# Altium schematic sheet Main.schdoc: Eurocard VME 6U with break-away tab (9.187 x 6.299 inches)
size A3; Organization: Organization; Address1: Address1; Address2: Address2; Address3: Address3; Address4: Address4; DocumentNumber: 1; Revision: 0; SheetNumber: 2; SheetTotal: 2
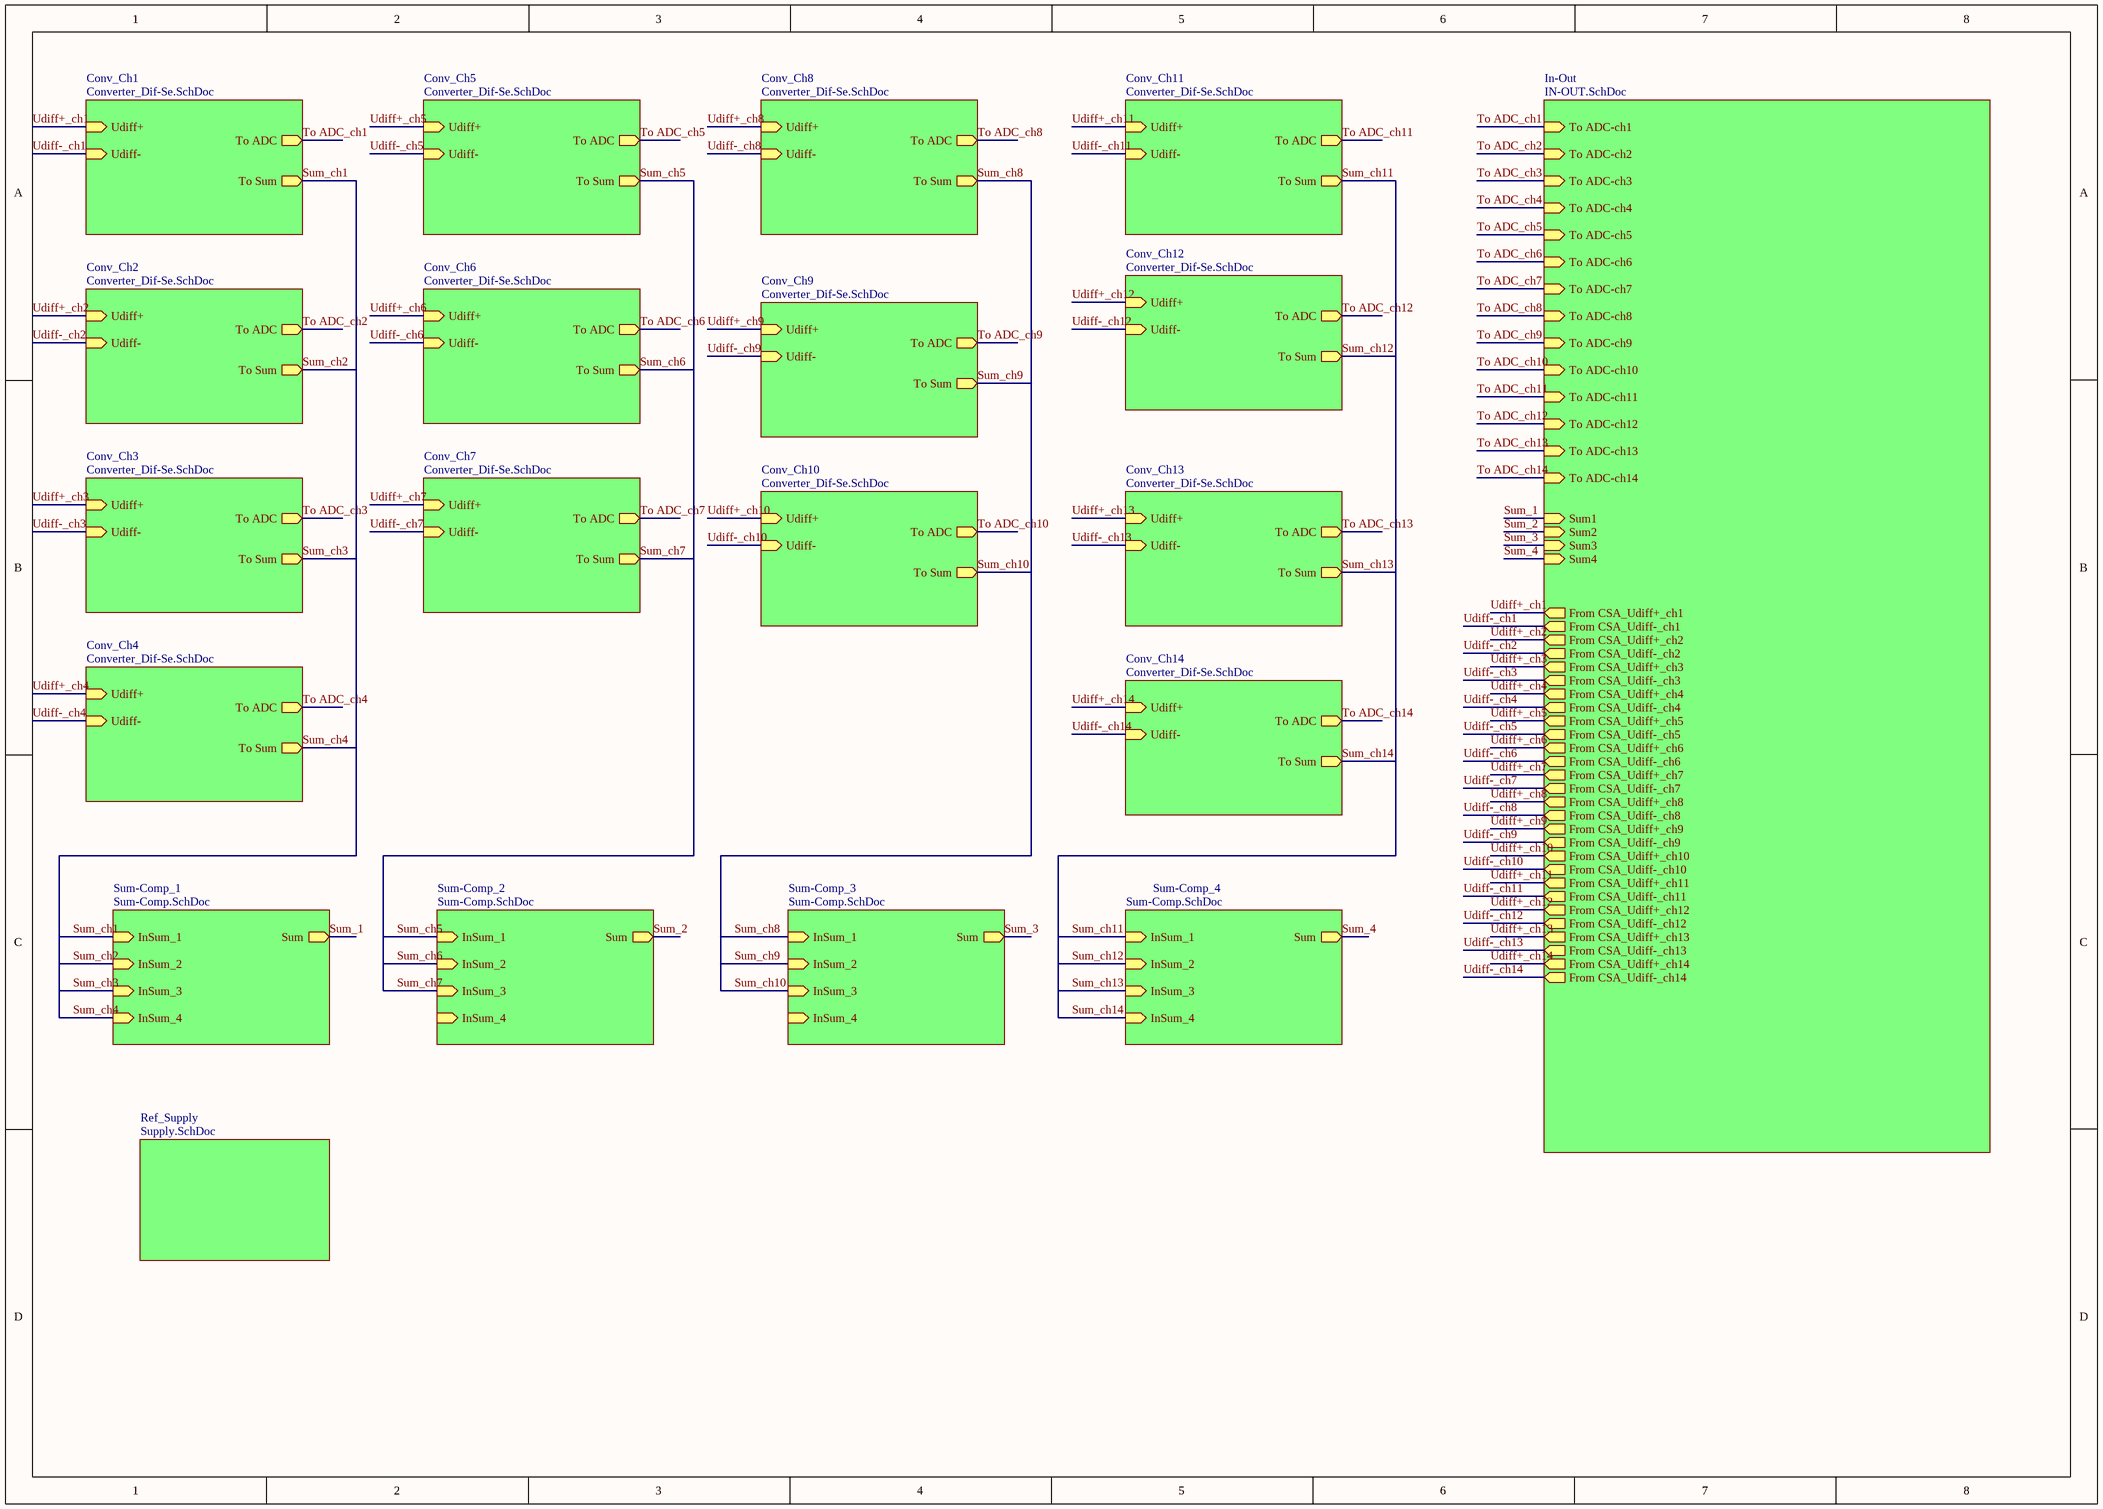
[diagram p0: Main.schdoc]

## Sub-sheets
Conv_Ch1 = Converter_Dif-Se.SchDoc: To ADC (out), To Sum (out), Udiff+ (in), Udiff- (in)
Conv_Ch2 = Converter_Dif-Se.SchDoc: To ADC (out), To Sum (out), Udiff+ (in), Udiff- (in)
Conv_Ch3 = Converter_Dif-Se.SchDoc: To ADC (out), To Sum (out), Udiff+ (in), Udiff- (in)
Conv_Ch4 = Converter_Dif-Se.SchDoc: To ADC (out), To Sum (out), Udiff+ (in), Udiff- (in)
Conv_Ch5 = Converter_Dif-Se.SchDoc: To ADC (out), To Sum (out), Udiff+ (in), Udiff- (in)
Conv_Ch6 = Converter_Dif-Se.SchDoc: To ADC (out), To Sum (out), Udiff+ (in), Udiff- (in)
Conv_Ch7 = Converter_Dif-Se.SchDoc: To ADC (out), To Sum (out), Udiff+ (in), Udiff- (in)
Conv_Ch8 = Converter_Dif-Se.SchDoc: To ADC (out), To Sum (out), Udiff+ (in), Udiff- (in)
Conv_Ch9 = Converter_Dif-Se.SchDoc: To ADC (out), To Sum (out), Udiff+ (in), Udiff- (in)
Conv_Ch10 = Converter_Dif-Se.SchDoc: To ADC (out), To Sum (out), Udiff+ (in), Udiff- (in)
Conv_Ch11 = Converter_Dif-Se.SchDoc: To ADC (out), To Sum (out), Udiff+ (in), Udiff- (in)
Conv_Ch12 = Converter_Dif-Se.SchDoc: To ADC (out), To Sum (out), Udiff+ (in), Udiff- (in)
Conv_Ch13 = Converter_Dif-Se.SchDoc: To ADC (out), To Sum (out), Udiff+ (in), Udiff- (in)
Conv_Ch14 = Converter_Dif-Se.SchDoc: To ADC (out), To Sum (out), Udiff+ (in), Udiff- (in)
In-Out = IN-OUT.SchDoc: To ADC-ch1 (in), To ADC-ch2 (in), To ADC-ch3 (in), To ADC-ch4 (in), To ADC-ch5 (in), To ADC-ch6 (in), To ADC-ch7 (in), To ADC-ch8 (in), To ADC-ch9 (in), To ADC-ch10 (in), To ADC-ch11 (in), To ADC-ch12 (in), To ADC-ch13 (in), To ADC-ch14 (in), From CSA_Udiff+_ch1 (out), From CSA_Udiff+_ch2 (out), From CSA_Udiff+_ch3 (out), From CSA_Udiff+_ch4 (out), From CSA_Udiff+_ch5 (out), From CSA_Udiff+_ch6 (out), From CSA_Udiff+_ch7 (out), From CSA_Udiff+_ch8 (out), From CSA_Udiff+_ch9 (out), From CSA_Udiff+_ch10 (out), From CSA_Udiff+_ch11 (out), From CSA_Udiff+_ch12 (out), From CSA_Udiff+_ch13 (out), From CSA_Udiff+_ch14 (out), From CSA_Udiff-_ch1 (out), From CSA_Udiff-_ch2 (out), From CSA_Udiff-_ch3 (out), From CSA_Udiff-_ch4 (out), From CSA_Udiff-_ch5 (out), From CSA_Udiff-_ch6 (out), From CSA_Udiff-_ch7 (out), From CSA_Udiff-_ch8 (out), From CSA_Udiff-_ch9 (out), From CSA_Udiff-_ch10 (out), From CSA_Udiff-_ch11 (out), From CSA_Udiff-_ch12 (out), From CSA_Udiff-_ch13 (out), From CSA_Udiff-_ch14 (out), Sum4 (in), Sum3 (in), Sum2 (in), Sum1 (in)
Ref_Supply = Supply.SchDoc: no entries
Sum-Comp_1 = Sum-Comp.SchDoc: InSum_1 (in), InSum_2 (in), InSum_3 (in), InSum_4 (in), Sum (out)
Sum-Comp_2 = Sum-Comp.SchDoc: InSum_1 (in), InSum_2 (in), InSum_3 (in), InSum_4 (in), Sum (out)
Sum-Comp_3 = Sum-Comp.SchDoc: InSum_1 (in), InSum_2 (in), InSum_3 (in), InSum_4 (in), Sum (out)
Sum-Comp_4 = Sum-Comp.SchDoc: InSum_1 (in), InSum_2 (in), InSum_3 (in), InSum_4 (in), Sum (out)

## Nets
Sum_1: sheet Sum-Comp_1/Sum, sheet In-Out/Sum1
Sum_2: sheet Sum-Comp_2/Sum, sheet In-Out/Sum2
Sum_3: sheet Sum-Comp_3/Sum, sheet In-Out/Sum3
Sum_4: sheet Sum-Comp_4/Sum, sheet In-Out/Sum4
Sum_ch1: sheet Conv_Ch1/To Sum, sheet Sum-Comp_1/InSum_1
Sum_ch2: sheet Sum-Comp_1/InSum_2, sheet Conv_Ch2/To Sum
Sum_ch3: sheet Sum-Comp_1/InSum_3, sheet Conv_Ch3/To Sum
Sum_ch4: sheet Sum-Comp_1/InSum_4, sheet Conv_Ch4/To Sum
Sum_ch5: sheet Sum-Comp_2/InSum_1, sheet Conv_Ch5/To Sum
Sum_ch6: sheet Sum-Comp_2/InSum_2, sheet Conv_Ch6/To Sum
Sum_ch7: sheet Sum-Comp_2/InSum_3, sheet Conv_Ch7/To Sum
Sum_ch8: sheet Sum-Comp_3/InSum_1, sheet Conv_Ch8/To Sum
Sum_ch9: sheet Sum-Comp_3/InSum_2, sheet Conv_Ch9/To Sum
Sum_ch10: sheet Sum-Comp_3/InSum_3, sheet Conv_Ch10/To Sum
Sum_ch11: sheet Sum-Comp_4/InSum_1, sheet Conv_Ch11/To Sum
Sum_ch12: sheet Sum-Comp_4/InSum_2, sheet Conv_Ch12/To Sum
Sum_ch13: sheet Sum-Comp_4/InSum_3, sheet Conv_Ch13/To Sum
Sum_ch14: sheet Sum-Comp_4/InSum_4, sheet Conv_Ch14/To Sum
To ADC_ch1: sheet Conv_Ch1/To ADC, sheet In-Out/To ADC-ch1
To ADC_ch2: sheet Conv_Ch2/To ADC, sheet In-Out/To ADC-ch2
To ADC_ch3: sheet Conv_Ch3/To ADC, sheet In-Out/To ADC-ch3
To ADC_ch4: sheet Conv_Ch4/To ADC, sheet In-Out/To ADC-ch4
To ADC_ch5: sheet Conv_Ch5/To ADC, sheet In-Out/To ADC-ch5
To ADC_ch6: sheet Conv_Ch6/To ADC, sheet In-Out/To ADC-ch6
To ADC_ch7: sheet Conv_Ch7/To ADC, sheet In-Out/To ADC-ch7
To ADC_ch8: sheet Conv_Ch8/To ADC, sheet In-Out/To ADC-ch8
To ADC_ch9: sheet Conv_Ch9/To ADC, sheet In-Out/To ADC-ch9
To ADC_ch10: sheet Conv_Ch10/To ADC, sheet In-Out/To ADC-ch10
To ADC_ch11: sheet Conv_Ch11/To ADC, sheet In-Out/To ADC-ch11
To ADC_ch12: sheet Conv_Ch12/To ADC, sheet In-Out/To ADC-ch12
To ADC_ch13: sheet Conv_Ch13/To ADC, sheet In-Out/To ADC-ch13
To ADC_ch14: sheet Conv_Ch14/To ADC, sheet In-Out/To ADC-ch14
Udiff+_ch1: sheet Conv_Ch1/Udiff+, sheet In-Out/From CSA_Udiff+_ch1
Udiff+_ch2: sheet Conv_Ch2/Udiff+, sheet In-Out/From CSA_Udiff+_ch2
Udiff+_ch3: sheet Conv_Ch3/Udiff+, sheet In-Out/From CSA_Udiff+_ch3
Udiff+_ch4: sheet Conv_Ch4/Udiff+, sheet In-Out/From CSA_Udiff+_ch4
Udiff+_ch5: sheet Conv_Ch5/Udiff+, sheet In-Out/From CSA_Udiff+_ch5
Udiff+_ch6: sheet Conv_Ch6/Udiff+, sheet In-Out/From CSA_Udiff+_ch6
Udiff+_ch7: sheet Conv_Ch7/Udiff+, sheet In-Out/From CSA_Udiff+_ch7
Udiff+_ch8: sheet Conv_Ch8/Udiff+, sheet In-Out/From CSA_Udiff+_ch8
Udiff+_ch9: sheet Conv_Ch9/Udiff+, sheet In-Out/From CSA_Udiff+_ch9
Udiff+_ch10: sheet Conv_Ch10/Udiff+, sheet In-Out/From CSA_Udiff+_ch10
Udiff+_ch11: sheet Conv_Ch11/Udiff+, sheet In-Out/From CSA_Udiff+_ch11
Udiff+_ch12: sheet Conv_Ch12/Udiff+, sheet In-Out/From CSA_Udiff+_ch12
Udiff+_ch13: sheet Conv_Ch13/Udiff+, sheet In-Out/From CSA_Udiff+_ch13
Udiff+_ch14: sheet Conv_Ch14/Udiff+, sheet In-Out/From CSA_Udiff+_ch14
Udiff-_ch1: sheet Conv_Ch1/Udiff-, sheet In-Out/From CSA_Udiff-_ch1
Udiff-_ch2: sheet Conv_Ch2/Udiff-, sheet In-Out/From CSA_Udiff-_ch2
Udiff-_ch3: sheet Conv_Ch3/Udiff-, sheet In-Out/From CSA_Udiff-_ch3
Udiff-_ch4: sheet Conv_Ch4/Udiff-, sheet In-Out/From CSA_Udiff-_ch4
Udiff-_ch5: sheet Conv_Ch5/Udiff-, sheet In-Out/From CSA_Udiff-_ch5
Udiff-_ch6: sheet Conv_Ch6/Udiff-, sheet In-Out/From CSA_Udiff-_ch6
Udiff-_ch7: sheet Conv_Ch7/Udiff-, sheet In-Out/From CSA_Udiff-_ch7
Udiff-_ch8: sheet Conv_Ch8/Udiff-, sheet In-Out/From CSA_Udiff-_ch8
Udiff-_ch9: sheet Conv_Ch9/Udiff-, sheet In-Out/From CSA_Udiff-_ch9
Udiff-_ch10: sheet Conv_Ch10/Udiff-, sheet In-Out/From CSA_Udiff-_ch10
Udiff-_ch11: sheet Conv_Ch11/Udiff-, sheet In-Out/From CSA_Udiff-_ch11
Udiff-_ch12: sheet Conv_Ch12/Udiff-, sheet In-Out/From CSA_Udiff-_ch12
Udiff-_ch13: sheet Conv_Ch13/Udiff-, sheet In-Out/From CSA_Udiff-_ch13
Udiff-_ch14: sheet Conv_Ch14/Udiff-, sheet In-Out/From CSA_Udiff-_ch14